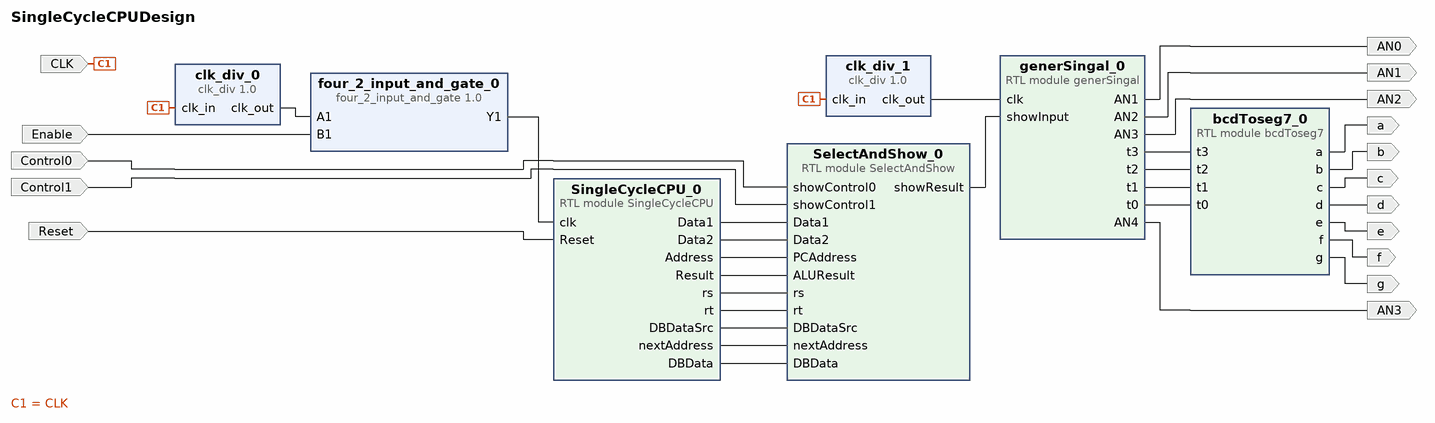
[diagram p0: block diagram of the top level]
# Vivado block design SingleCycleCPUDesign, xc7a35tcpg236-1, Vivado 2017.2
create_bd_design SingleCycleCPUDesign

create_bd_port -dir I CLK
create_bd_port -dir I Enable
create_bd_port -dir O AN0
create_bd_port -dir O AN1
create_bd_port -dir O AN2
create_bd_port -dir O AN3
create_bd_port -dir O a
create_bd_port -dir O b
create_bd_port -dir O c
create_bd_port -dir O d
create_bd_port -dir O e
create_bd_port -dir O f
create_bd_port -dir O g
create_bd_port -dir I Control0
create_bd_port -dir I Control1
create_bd_port -dir I -type rst Reset

create_bd_cell -type ip -vlnv xilinx.com:xup:clk_div:1.0 clk_div_0
create_bd_cell -type ip -vlnv xilinx.com:XUP:four_2_input_and_gate:1.0 four_2_input_and_gate_0
create_bd_cell -type ip -vlnv xilinx.com:xup:clk_div:1.0 clk_div_1
set_property -dict {CONFIG.N 10000} [get_bd_cells clk_div_1]
create_bd_cell -type module -reference bcdToseg7 bcdToseg7_0
create_bd_cell -type module -reference SelectAndShow SelectAndShow_0
create_bd_cell -type module -reference generSingal generSingal_0
create_bd_cell -type module -reference SingleCycleCPU SingleCycleCPU_0

# ---- connections ----

connect_bd_net [get_bd_ports CLK] [get_bd_pins clk_div_0/clk_in] [get_bd_pins clk_div_1/clk_in]
connect_bd_net [get_bd_pins clk_div_0/clk_out] [get_bd_pins four_2_input_and_gate_0/A1]
connect_bd_net -net B1_1 [get_bd_ports Enable] [get_bd_pins four_2_input_and_gate_0/B1]
connect_bd_net [get_bd_pins clk_div_1/clk_out] [get_bd_pins generSingal_0/clk]
connect_bd_net [get_bd_pins generSingal_0/AN1] [get_bd_ports AN0]
connect_bd_net [get_bd_pins generSingal_0/AN2] [get_bd_ports AN1]
connect_bd_net [get_bd_pins generSingal_0/AN3] [get_bd_ports AN2]
connect_bd_net [get_bd_pins generSingal_0/AN4] [get_bd_ports AN3]
connect_bd_net [get_bd_pins generSingal_0/t3] [get_bd_pins bcdToseg7_0/t3]
connect_bd_net [get_bd_pins generSingal_0/t2] [get_bd_pins bcdToseg7_0/t2]
connect_bd_net [get_bd_pins generSingal_0/t1] [get_bd_pins bcdToseg7_0/t1]
connect_bd_net [get_bd_pins generSingal_0/t0] [get_bd_pins bcdToseg7_0/t0]
connect_bd_net [get_bd_pins bcdToseg7_0/a] [get_bd_ports a]
connect_bd_net [get_bd_pins bcdToseg7_0/b] [get_bd_ports b]
connect_bd_net [get_bd_pins bcdToseg7_0/c] [get_bd_ports c]
connect_bd_net [get_bd_pins bcdToseg7_0/d] [get_bd_ports d]
connect_bd_net [get_bd_pins bcdToseg7_0/e] [get_bd_ports e]
connect_bd_net [get_bd_pins bcdToseg7_0/f] [get_bd_ports f]
connect_bd_net [get_bd_pins bcdToseg7_0/g] [get_bd_ports g]
connect_bd_net -net Control0_1 [get_bd_ports Control0] [get_bd_pins SelectAndShow_0/showControl0]
connect_bd_net -net Control1_1 [get_bd_ports Control1] [get_bd_pins SelectAndShow_0/showControl1]
connect_bd_net -net SelectShow_0_showResult [get_bd_pins SelectAndShow_0/showResult] [get_bd_pins generSingal_0/showInput]
connect_bd_net [get_bd_pins four_2_input_and_gate_0/Y1] [get_bd_pins SingleCycleCPU_0/clk]
connect_bd_net [get_bd_ports Reset] [get_bd_pins SingleCycleCPU_0/Reset]
connect_bd_net [get_bd_pins SingleCycleCPU_0/Data1] [get_bd_pins SelectAndShow_0/Data1]
connect_bd_net [get_bd_pins SingleCycleCPU_0/Data2] [get_bd_pins SelectAndShow_0/Data2]
connect_bd_net [get_bd_pins SingleCycleCPU_0/Address] [get_bd_pins SelectAndShow_0/PCAddress]
connect_bd_net [get_bd_pins SingleCycleCPU_0/Result] [get_bd_pins SelectAndShow_0/ALUResult]
# net SingleCycleCPU_0_DataMemOut has one end: 
connect_bd_net [get_bd_pins SingleCycleCPU_0/rs] [get_bd_pins SelectAndShow_0/rs]
connect_bd_net [get_bd_pins SingleCycleCPU_0/rt] [get_bd_pins SelectAndShow_0/rt]
connect_bd_net [get_bd_pins SingleCycleCPU_0/DBDataSrc] [get_bd_pins SelectAndShow_0/DBDataSrc]
connect_bd_net [get_bd_pins SingleCycleCPU_0/nextAddress] [get_bd_pins SelectAndShow_0/nextAddress]
connect_bd_net [get_bd_pins SingleCycleCPU_0/DBData] [get_bd_pins SelectAndShow_0/DBData]

validate_bd_design
save_bd_design
